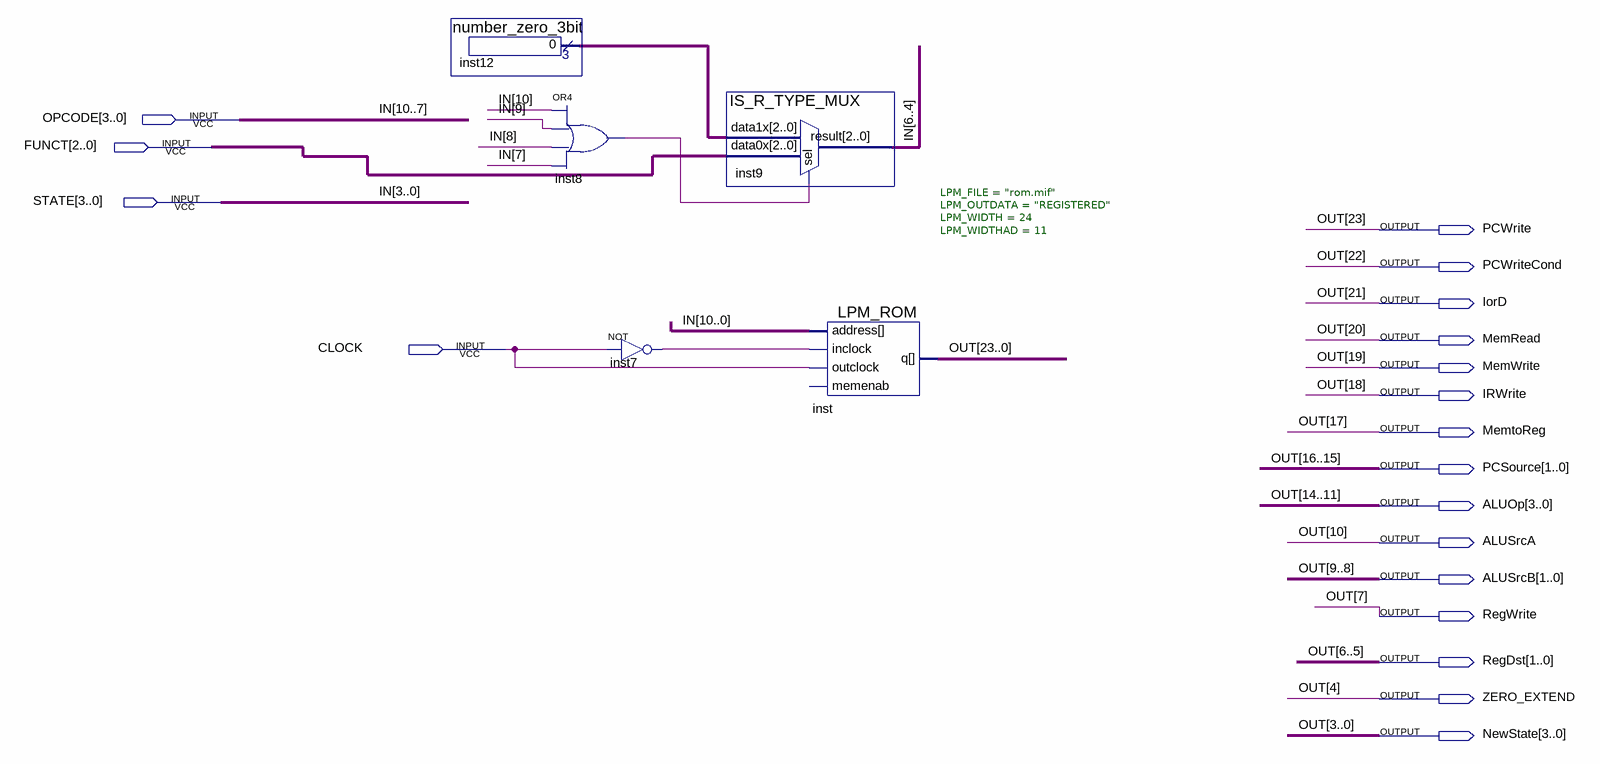
[diagram p0: schematic sheet]
// Quartus schematic Control_Multi_Cycle.bdf as structural Verilog: 5 symbols, 19 pins
module Control_Multi_Cycle (
  input  [3:0] OPCODE,
  input  [2:0] FUNCT,
  input  [3:0] STATE,
  input  CLOCK,
  output PCWrite,
  output PCWriteCond,
  output IorD,
  output MemRead,
  output MemWrite,
  output IRWrite,
  output MemtoReg,
  output [1:0] PCSource,
  output [3:0] ALUOp,
  output ALUSrcA,
  output [1:0] ALUSrcB,
  output RegWrite,
  output [1:0] RegDst,
  output ZERO_EXTEND,
  output [3:0] NewState
);

  wire inst7_out, inst8_out;
  wire [2:0] inst12_result;
  wire [6:4] IN;

  number_zero_3bit inst12 (.result(inst12_result));
  or inst8 (inst8_out, OPCODE[3], OPCODE[2], OPCODE[1], OPCODE[0]);
  not inst7 (inst7_out, CLOCK);
  IS_R_TYPE_MUX inst9 (.data1x(inst12_result), .data0x(FUNCT), .sel(inst8_out), .result(IN));
  LPM_ROM #(.LPM_FILE("rom.mif"), .LPM_OUTDATA("REGISTERED"), .LPM_WIDTH(24), .LPM_WIDTHAD(11)) inst (
    .address({OPCODE, IN, STATE}), .inclock(inst7_out), .outclock(CLOCK),
    .q({PCWrite, PCWriteCond, IorD, MemRead, MemWrite, IRWrite, MemtoReg, PCSource, ALUOp, ALUSrcA, ALUSrcB, RegWrite, RegDst, ZERO_EXTEND, NewState}));  // open: memenab

  // Other names for the same wires on the sheet: IN (some bits) = {OPCODE, STATE};
  //   OUT[23:0] = {PCWrite, PCWriteCond, IorD, MemRead, MemWrite, IRWrite, MemtoReg, PCSource, ALUOp, ALUSrcA, ALUSrcB, RegWrite, RegDst, ZERO_EXTEND, NewState}
endmodule
